# Altium project DEV_BOARD.PrjPcb
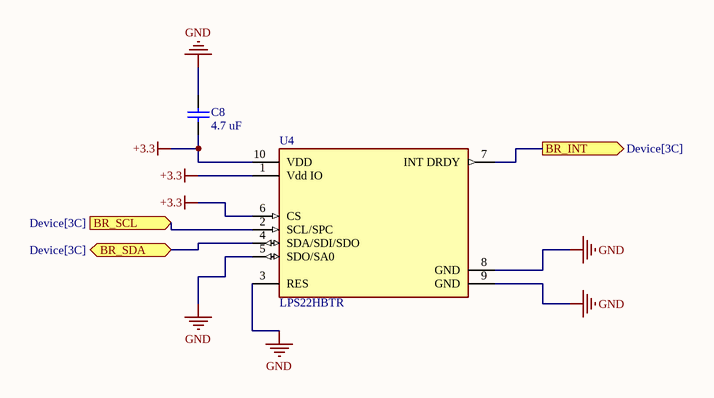
[diagram p0: LPS22HBTR.SchDoc]
3 sheets, 10 parts. Net scope: flat (ports and power ports of the same name join across sheets).
Board file: Device.PcbDoc
Sheets:
  LPS22HBTR.SchDoc
  LSM6DSRXTR.SchDoc
  SWD.SchDoc

## Sheet LPS22HBTR.SchDoc
size A4; SheetNumber: 4; SheetTotal: 11

### Parts
C8  4.7 uF  [CAPC1005X55X25NL05T10]
U4  LPS22HBTR  [FP-HLGA-10L-8479831-0]

### Ports
BR_INT (out, see Device[3C]), BR_SCL (in, see Device[3C]), BR_SDA (bidir, see Device[3C])

### Nets
+3.3: C8.2 U4.1(Vdd_IO) U4.6(CS) U4.10(VDD)
GND: C8.1 U4.3(RES) U4.5(SDO/SA0) U4.8(GND) U4.9(GND)
NetU4_2: U4.2(SCL/SPC) ; port BR_SCL
NetU4_4: U4.4(SDA/SDI/SDO) ; port BR_SDA
NetU4_7: U4.7(INT_DRDY) ; port BR_INT

### Library data of the parts
C8 = CMP-2008-04515-1: Manufacturer: Murata; Part Number: GRM155F50J684ZE01D
U4 = CMP-12182-000004-1: MEMS NANO PRESSURE SENSOR: 260-1; Manufacturer: STMicroelectronics; Sensor Output: I2C,SPI; Port Style: No Port; Max Supply Voltage: 3.6V; Operating Supply Current: 3-12uA; Min Supply Voltage: 1.7V; Device Class L3: unset; Device Class L1: Sensors; Manufacturer Part Number: LPS22HBTR; Temperature Range High: +85°C; Digikey Description: MEMS NANO PRESSURE SENSOR: 260-1; Device Class L2: Pressure Sensors; RoHS: TRUE; Lead Free: Yes; Height: 0.8mm; Automotive: No; Octopart: https://octopart.com/lps22hbtr-stmicroelectronics-51851131; Package: HLGA-10L-8479831; Temperature Range Low: -40°C; Category: IC; Temperature: -40°C to +85°C; ComponentLink2Description: Datasheet; ComponentLink2URL: https://www.st.com/resource/en/datasheet/lps22hb.pdf; Footprint Url: https://www.st.com/content/ccc/resource/technical/document/technical_note/73/17/9c/16/dd/96/4a/01/CD00134799.pdf/files/CD00134799.pdf/jcr:content/translations/en.CD00134799.pdf

## Sheet LSM6DSRXTR.SchDoc
size A4; SheetNumber: 5; SheetTotal: 11
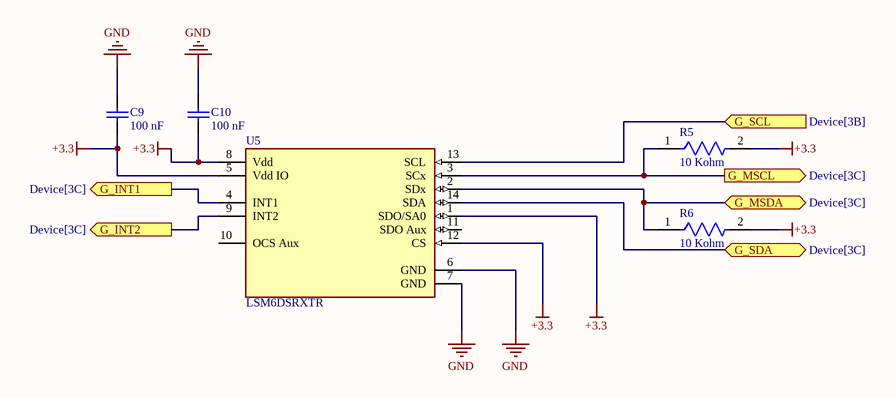
[diagram p1: LSM6DSRXTR.SchDoc]

### Parts
C9  100 nF  [CAPC1005X55X25NL05T10]
C10  100 nF  [CAPC1005X55X25NL05T10]
R5  10 Kohm  [FP-RC1005-IPC_C]
R6  10 Kohm  [FP-RC1005-IPC_C]
U5  LSM6DSRXTR  [FP-LGA-14L-DM00249496-MFG]

### Ports
G_INT1 (out, see Device[3C]), G_INT2 (out, see Device[3C]), G_MSCL (out, see Device[3C]), G_MSDA (bidir, see Device[3C]), G_SCL (in, see Device[3B]), G_SDA (bidir, see Device[3C])

### Nets
+3.3: C9.2 C10.2 R5.2 R6.2 U5.1(SDO/SA0) U5.5(Vdd_IO) U5.8(Vdd) U5.12(CS)
GND: C9.1 C10.1 U5.6(GND) U5.7(GND)
NetR5_1: R5.1 U5.3(SCx) ; port G_MSCL
NetR6_1: R6.1 U5.2(SDx) ; port G_MSDA
NetU5_4: U5.4(INT1) ; port G_INT1
NetU5_9: U5.9(INT2) ; port G_INT2
NetU5_13: U5.13(SCL) ; port G_SCL
NetU5_14: U5.14(SDA) ; port G_SDA

Not connected (* = marked no-connect by the designer): U5 10(OCS_Aux) 11(SDO_Aux)

### Library data of the parts
C9 C10 = CMP-2008-04515-1: as C8 on sheet LPS22HBTR
R5 R6 = CMP-13261-000953-1: Res Thick Film 0402 1.87kΩ 1% 0.063W ±100ppm/°C Molded SMD T/R; Power Rating: 63mW; Voltage Rating (DC): 50V; Resistance: 1.87kR; Tolerance: 1%; Height: 0.016inch; Length: 1mm; Case Code (Metric): 1005; Width: 0.02inch; Max Power Dissipation: 63mW; Radiation Hardening: No; Features: Moisture Resistant; Temperature Coefficient: 100ppm/°C; Min Operating Temperature: -55°C; Number of Terminations: 2; Max Operating Temperature: 155°C; Case Code (Imperial): 0402; Composition: Thick Film; Depth: 0.5mm; Lead Free: Lead Free; Package Quantity: 1; Case/Package: 0402; Packaging: Tape and Reel; Contact Plating: Tin; Military Standard: Not
U5 = CMP-12177-000016-1: CONSUMER MEMS; RoHS Compliant: Yes

## Sheet SWD.SchDoc
size A4; SheetNumber: 9; SheetTotal: 11
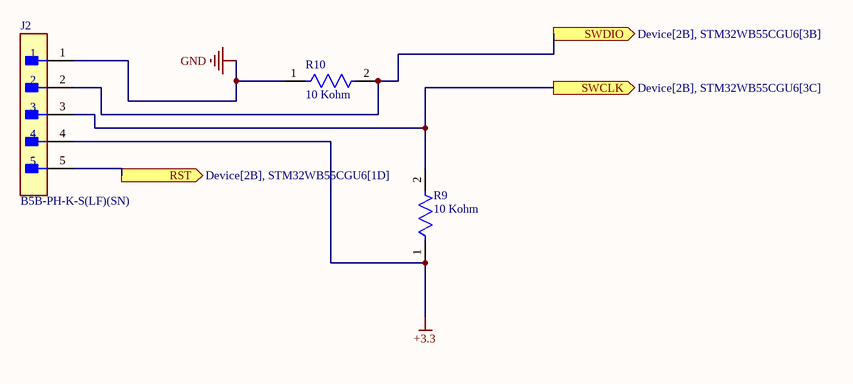
[diagram p2: SWD.SchDoc]

### Parts
J2  B5B-PH-K-S(LF)(SN)  [FP-B5B-PH-K-S_LF_SN-MFG]
R9  10 Kohm  [FP-RC1005-IPC_C]
R10  10 Kohm  [FP-RC1005-IPC_C]

### Ports
RST (out, see Device[2B], STM32WB55CGU6[1D]), SWCLK (out, see Device[2B], STM32WB55CGU6[3C]), SWDIO (out, see Device[2B], STM32WB55CGU6[3B])

### Nets
+3.3: J2.4 R9.1
GND: J2.1 R10.1
NetJ2_2: J2.2 R10.2 ; port SWDIO
NetJ2_3: J2.3 R9.2 ; port SWCLK
NetJ2_5: J2.5 ; port RST

### Library data of the parts
J2 = CMP-2000-05908-2: CONN HEADER VERT 5POS 2MM; Voltage Rating (AC): 100V; Number of Positions: 5; Contact Resistance: 20mR; Insulation Resistance: 1MR; Current Rating: 2A; Gender: Male; Mated Stacking Heights: 8mm; Series: PH; Number of Poles: 5; Width: 4.5mm; Insulation Color: Natural; Fastening Type: Detent; Flammability Rating: UL94 V-0; Mount: Through Hole; Lead Free: Lead Free; Number of Rows: 1; REACH SVHC: No SVHC; Max Voltage Rating (AC): 100V; Contact Mating Length: 0.13inch; Contact Plating: Tin; Housing Material: Polyamide; Depth: 4.5mm; Contact Type: Male Pin; Voltage Rating: 100V; Color: Natural; Housing Color: White; Lead Pitch: 2mm; Number of Contacts: 5; Orientation: Straight; Packaging: Bulk; Contact Material: Brass; Pitch: 2mm; Insulation Material: Nylon; Connector Type: Header; Contact Finish - Mating: TIN; Termination: Solder; Number of Pins: 5; Length: 11.9mm; Contact Shape: Square; Max Current Rating: 2A; Working Voltage: 100V; Min Operating Temperature: -25°C; Max Operating Temperature: 85°C; Material: Polyamide; Height: 9.4mm
R9 R10 = CMP-13261-000953-1: as R5 on sheet LSM6DSRXTR; Tolerance: 1%; Height: 0.016inch; Length: 1mm; Case Code (Metric): 1005; Width: 0.02inch; Max Power Dissipation: 63mW; Radiation Hardening: No; Features: Moisture Resistant; Temperature Coefficient: 100ppm/°C; Min Operating Temperature: -55°C; Number of Terminations: 2; Max Operating Temperature: 155°C; Case Code (Imperial): 0402; Composition: Thick Film; Depth: 0.5mm; Lead Free: Lead Free; Package Quantity: 1; Case/Package: 0402; Packaging: Tape and Reel; Contact Plating: Tin; Military Standard: Not

## Nets that join several sheets
+3.3: LPS22HBTR (C8.2 U4.1 U4.6 U4.10), LSM6DSRXTR (8 pins), SWD (J2.4 R9.1)
GND: LPS22HBTR (5 pins), LSM6DSRXTR (C9.1 C10.1 U5.6 U5.7), SWD (J2.1 R10.1)